# Altium schematic sheet DDR4 Interface.SchDoc
size A2; DocumentNumber: 4; SheetNumber: 4; SheetTotal: 14
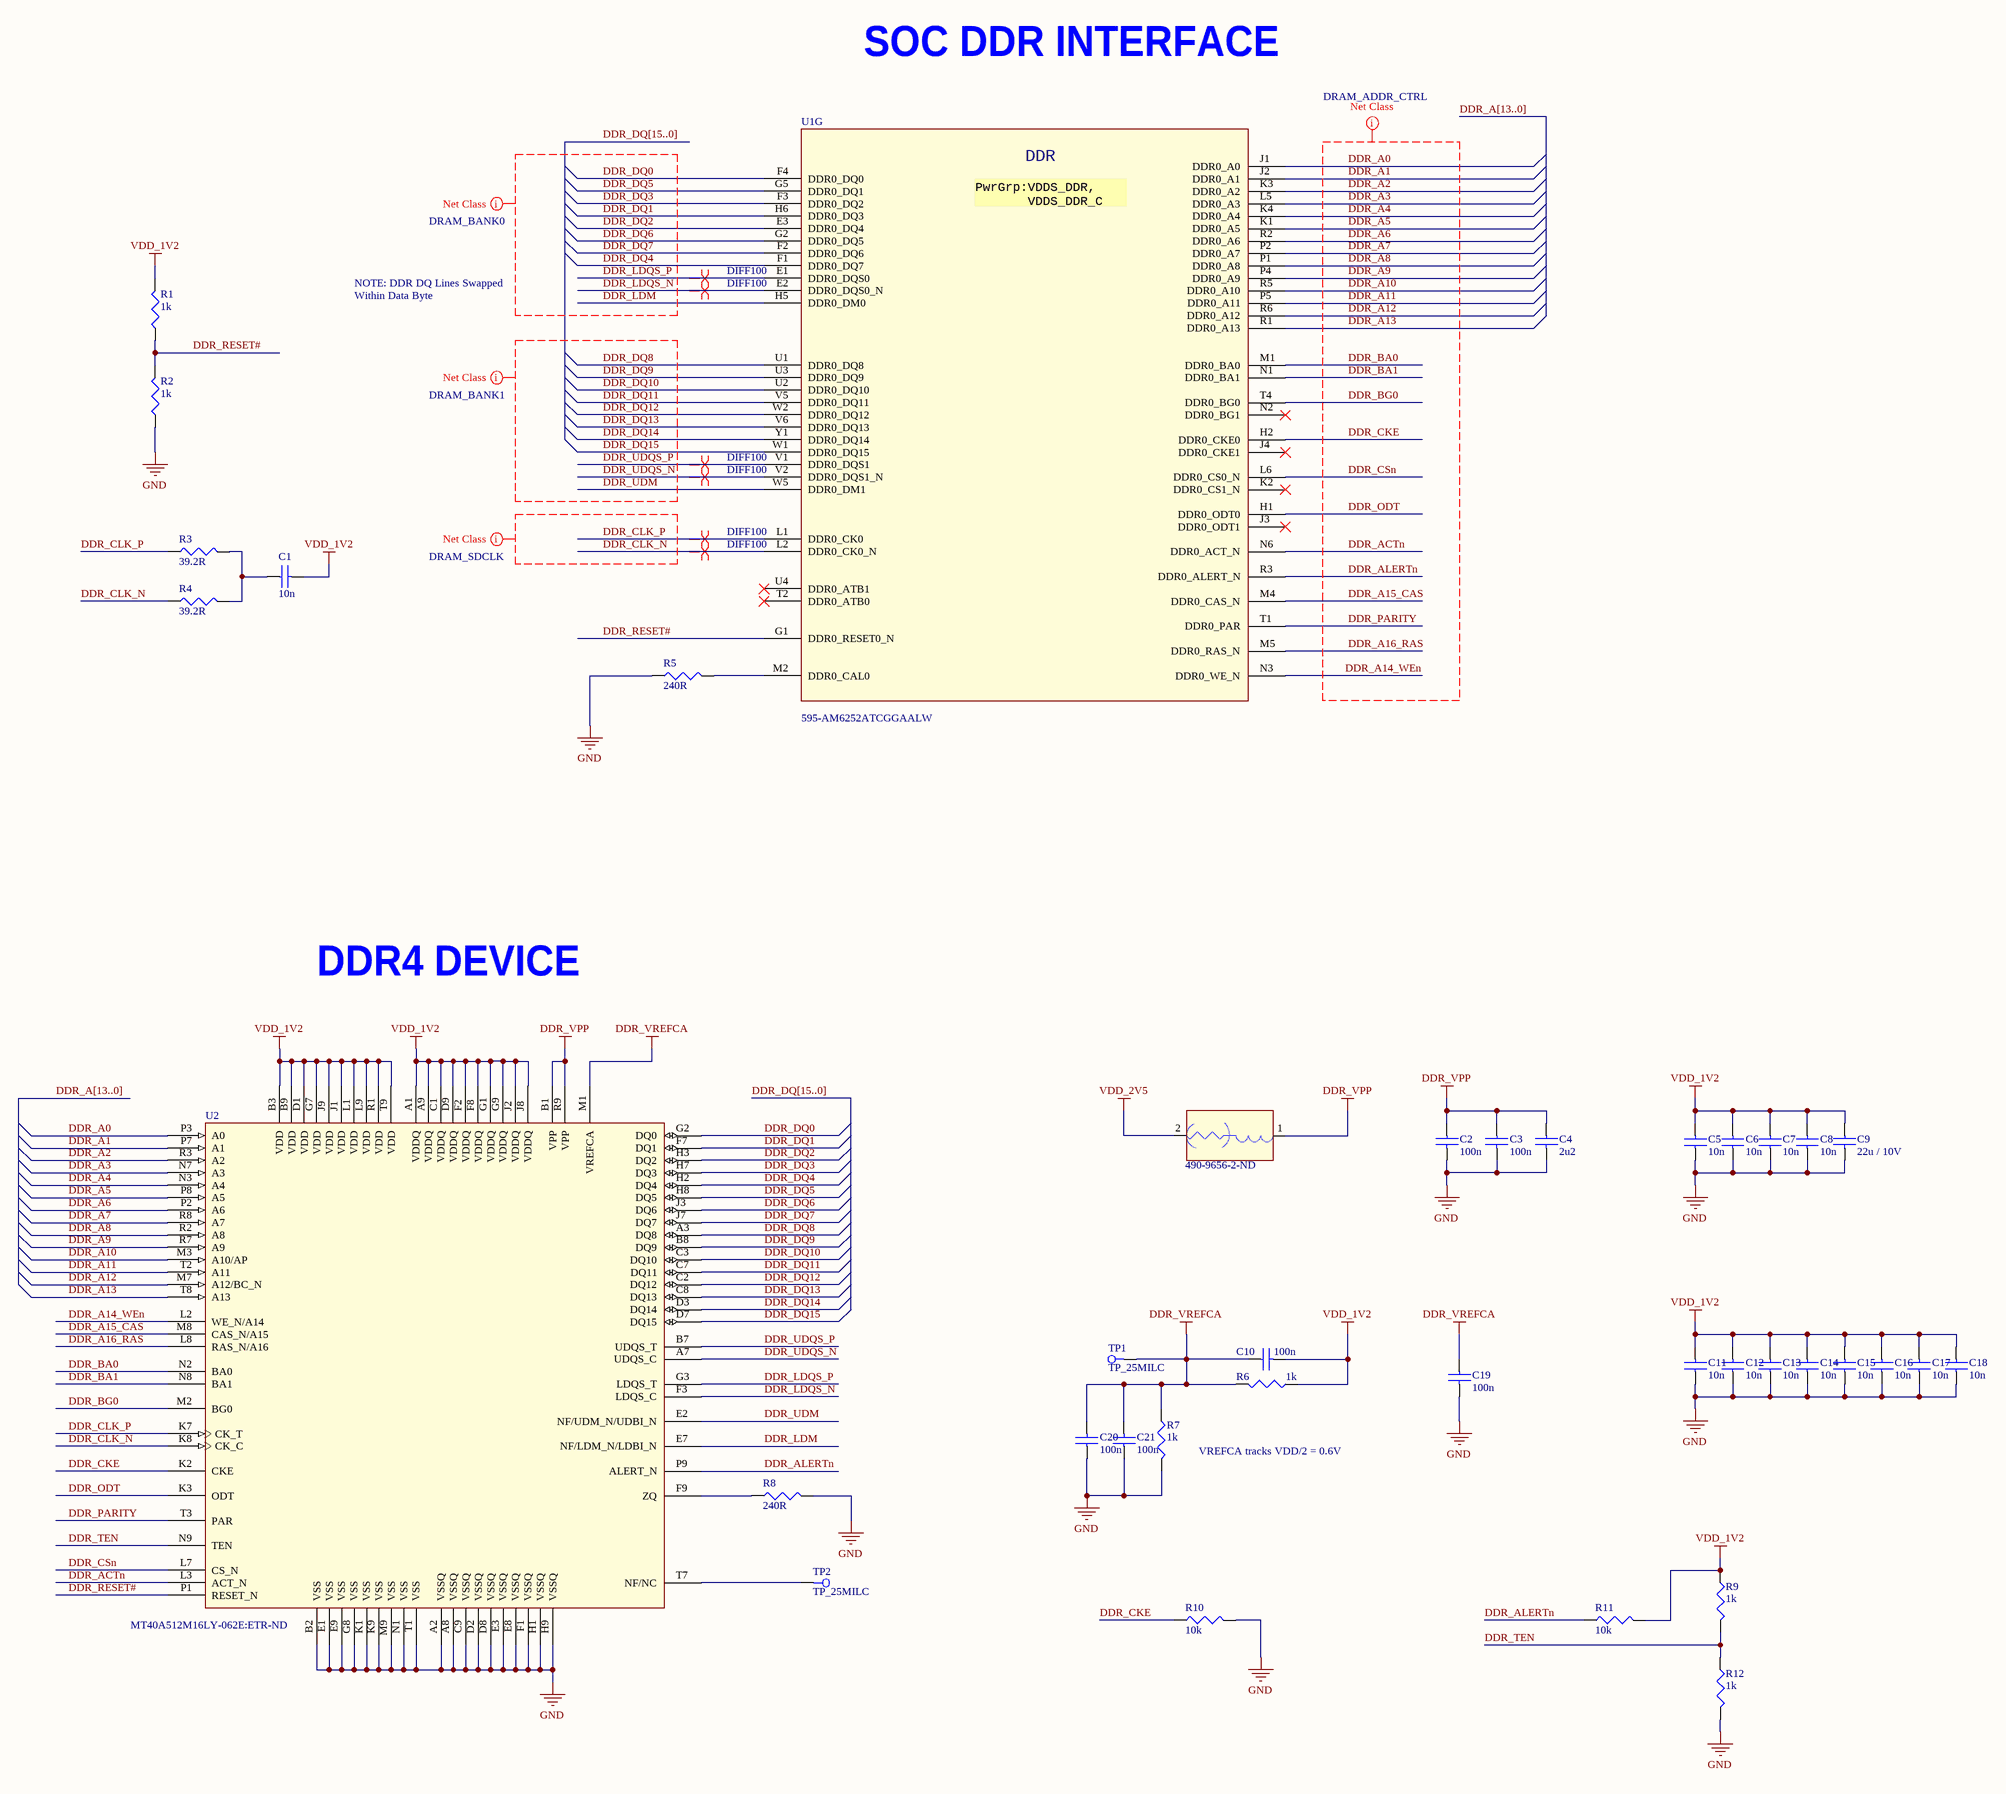
[diagram p0: DDR4 Interface.SchDoc]

## Parts
C1  10n  [C0201]
C2  100n  [C0201]
C3  100n  [C0201]
C4  2u2  [C0402]
C5  10n  [C0201]
C6  10n  [C0201]
C7  10n  [C0201]
C8  10n  [C0201]
C9  22u / 10V  [C0603]
C10  100n  [C0201]
C11  10n  [C0201]
C12  10n  [C0201]
C13  10n  [C0201]
C14  10n  [C0201]
C15  10n  [C0201]
C16  10n  [C0201]
C17  10n  [C0201]
C18  10n  [C0201]
C19  100n  [C0201]
C20  100n  [C0201]
C21  100n  [C0201]
FL1  Supplier Part Number 1: 490-9656-2-ND  [NFZ15SG152SN10B]  (hidden comment: BLM15PX121SN1D)
R1  1k  [R0201]
R2  1k  [R0201]
R3  39.2R  [R0402]
R4  39.2R  [R0402]
R5  240R  [R0201]
R6  1k  [R0201]
R7  1k  [R0201]
R8  240R  [R0402]
R9  1k  [R0201]
R10  10k  [R0201]
R11  10k  [R0201]
R12  1k  [R0201]
TP1  TP_25MILC  [TP_25C]  (no BOM)
TP2  TP_25MILC  [TP_25C]  (no BOM)
U1  Supplier Part Number 1: 595-AM6252ATCGGAALW  [BGA425C50P25X25_1300X1300X89]  (hidden comment: AM62-EVM_BGA425)  (part G of 18)
U2  Supplier Part Number 1: MT40A512M16LY-062E:ETR-ND  [BGA96C80P9X16_750X1350X120]  (hidden comment: MT40A512M16LY_FBGA96)

## Nets
DDR_VPP: C2.1 C3.1 C4.1 FL1.1 U2.B1(VPP) U2.R9(VPP)
DDR_VREFCA: C10.1 C19.1 C20.2 C21.2 R6.2 R7.1 TP1.1 U2.M1(VREFCA)
GND: C2.2 C3.2 C4.2 C5.1 C6.1 C7.1 C8.1 C9.2 C11.1 C12.1 C13.1 C14.1 C15.1 C16.1 C17.1 C18.1 C19.2 C20.1 C21.1 R2.1 R5.1 R7.2 R8.2 R10.2 R12.2 U2.A2(VSSQ) U2.A8(VSSQ) U2.B2(VSS) U2.C9(VSSQ) U2.D2(VSSQ) U2.D8(VSSQ) U2.E1(VSS) U2.E3(VSSQ) U2.E8(VSSQ) U2.E9(VSS) U2.F1(VSSQ) U2.G8(VSS) U2.H1(VSSQ) U2.H9(VSSQ) U2.K1(VSS) U2.K9(VSS) U2.M9(VSS) U2.N1(VSS) U2.T1(VSS)
VDD_1V2: C1.2 C5.2 C6.2 C7.2 C8.2 C9.1 C10.2 C11.2 C12.2 C13.2 C14.2 C15.2 C16.2 C17.2 C18.2 R1.2 R6.1 R9.1 R11.2 U2.A1(VDDQ) U2.A9(VDDQ) U2.B3(VDD) U2.B9(VDD) U2.C1(VDDQ) U2.D1(VDD) U2.D9(VDDQ) U2.F2(VDDQ) U2.F8(VDDQ) U2.G1(VDDQ) U2.G7(VDD) U2.G9(VDDQ) U2.J1(VDD) U2.J2(VDDQ) U2.J8(VDDQ) U2.J9(VDD) U2.L1(VDD) U2.L9(VDD) U2.R1(VDD) U2.T9(VDD)
VDD_2V5: FL1.2
DDR_A0: U1.J1(DDR0_A0) U2.P3(A0)
DDR_A1: U1.J2(DDR0_A1) U2.P7(A1)
DDR_A2: U1.K3(DDR0_A2) U2.R3(A2)
DDR_A3: U1.L5(DDR0_A3) U2.N7(A3)
DDR_A4: U1.K4(DDR0_A4) U2.N3(A4)
DDR_A5: U1.K1(DDR0_A5) U2.P8(A5)
DDR_A6: U1.R2(DDR0_A6) U2.P2(A6)
DDR_A7: U1.P2(DDR0_A7) U2.R8(A7)
DDR_A8: U1.P1(DDR0_A8) U2.R2(A8)
DDR_A9: U1.P4(DDR0_A9) U2.R7(A9)
DDR_A10: U1.R5(DDR0_A10) U2.M3(A10/AP)
DDR_A11: U1.P5(DDR0_A11) U2.T2(A11)
DDR_A12: U1.R6(DDR0_A12) U2.M7(A12/BC_N)
DDR_A13: U1.R1(DDR0_A13) U2.T8(A13)
DDR_A14_WEn: U1.N3(DDR0_WE_N) U2.L2(WE_N/A14)
DDR_A15_CAS: U1.M4(DDR0_CAS_N) U2.M8(CAS_N/A15)
DDR_A16_RAS: U1.M5(DDR0_RAS_N) U2.L8(RAS_N/A16)
DDR_ACTn: U1.N6(DDR0_ACT_N) U2.L3(ACT_N)
DDR_ALERTn: R11.1 U1.R3(DDR0_ALERT_N) U2.P9(ALERT_N)
DDR_BA0: U1.M1(DDR0_BA0) U2.N2(BA0)
DDR_BA1: U1.N1(DDR0_BA1) U2.N8(BA1)
DDR_BG0: U1.T4(DDR0_BG0) U2.M2(BG0)
DDR_CKE: R10.1 U1.H2(DDR0_CKE0) U2.K2(CKE)
DDR_CLK_N: R4.1 U1.L2(DDR0_CK0_N) U2.K8(CK_C)
DDR_CLK_P: R3.1 U1.L1(DDR0_CK0) U2.K7(CK_T)
DDR_CSn: U1.L6(DDR0_CS0_N) U2.L7(CS_N)
DDR_DQ0: U1.F4(DDR0_DQ0) U2.G2(DQ0)
DDR_DQ1: U1.H6(DDR0_DQ3) U2.F7(DQ1)
DDR_DQ2: U1.E3(DDR0_DQ4) U2.H3(DQ2)
DDR_DQ3: U1.F3(DDR0_DQ2) U2.H7(DQ3)
DDR_DQ4: U1.F1(DDR0_DQ7) U2.H2(DQ4)
DDR_DQ5: U1.G5(DDR0_DQ1) U2.H8(DQ5)
DDR_DQ6: U1.G2(DDR0_DQ5) U2.J3(DQ6)
DDR_DQ7: U1.F2(DDR0_DQ6) U2.J7(DQ7)
DDR_DQ8: U1.U1(DDR0_DQ8) U2.A3(DQ8)
DDR_DQ9: U1.U3(DDR0_DQ9) U2.B8(DQ9)
DDR_DQ10: U1.U2(DDR0_DQ10) U2.C3(DQ10)
DDR_DQ11: U1.V5(DDR0_DQ11) U2.C7(DQ11)
DDR_DQ12: U1.W2(DDR0_DQ12) U2.C2(DQ12)
DDR_DQ13: U1.V6(DDR0_DQ13) U2.C8(DQ13)
DDR_DQ14: U1.Y1(DDR0_DQ14) U2.D3(DQ14)
DDR_DQ15: U1.W1(DDR0_DQ15) U2.D7(DQ15)
DDR_LDM: U1.H5(DDR0_DM0) U2.E7(NF/LDM_N/LDBI_N)
DDR_LDQS_N: U1.E2(DDR0_DQS0_N) U2.F3(LDQS_C)
DDR_LDQS_P: U1.E1(DDR0_DQS0) U2.G3(LDQS_T)
DDR_ODT: U1.H1(DDR0_ODT0) U2.K3(ODT)
DDR_PARITY: U1.T1(DDR0_PAR) U2.T3(PAR)
DDR_RESET#: R1.1 R2.2 U1.G1(DDR0_RESET0_N) U2.P1(RESET_N)
DDR_TEN: R9.2 R12.1 U2.N9(TEN)
DDR_UDM: U1.W5(DDR0_DM1) U2.E2(NF/UDM_N/UDBI_N)
DDR_UDQS_N: U1.V2(DDR0_DQS1_N) U2.A7(UDQS_C)
DDR_UDQS_P: U1.V1(DDR0_DQS1) U2.B7(UDQS_T)
NetC1_1: C1.1 R3.2 R4.2
NetR5_2: R5.2 U1.M2(DDR0_CAL0)
NetR8_1: R8.1 U2.F9(ZQ)
NetTP2_1: TP2.1 U2.T7(NF/NC)

Not connected (* = marked no-connect by the designer): U1 J3(DDR0_ODT1)* J4(DDR0_CKE1)* K2(DDR0_CS1_N)* N2(DDR0_BG1)* T2(DDR0_ATB0)* U4(DDR0_ATB1)*

## Buses and harness runs
bus DDR_A[13..0]
bus DDR_DQ[15..0]

## Layout directives
net class DRAM_BANK0: DDR_DQ0, DDR_DQ1, DDR_DQ2, DDR_DQ3, DDR_DQ4, DDR_DQ5, DDR_DQ6, DDR_DQ7, DDR_LDM, DDR_LDQS_N, DDR_LDQS_P
net class DRAM_BANK1: DDR_DQ8, DDR_DQ9, DDR_DQ10, DDR_DQ11, DDR_DQ12, DDR_DQ13, DDR_DQ14, DDR_DQ15, DDR_UDM, DDR_UDQS_N, DDR_UDQS_P
net class DRAM_SDCLK: DDR_CLK_N, DDR_CLK_P
net class DRAM_ADDR_CTRL: DDR_A0, DDR_A1, DDR_A2, DDR_A3, DDR_A4, DDR_A5, DDR_A6, DDR_A7, DDR_A8, DDR_A9, DDR_A10, DDR_A11, DDR_A12, DDR_A13, DDR_A14_WEn, DDR_A15_CAS, DDR_A16_RAS, DDR_ACTn, DDR_ALERTn, DDR_BA0, DDR_BA1, DDR_BG0, DDR_CKE, DDR_CSn, DDR_ODT, DDR_PARITY
differential pair; net class DIFF100: DDR_CLK_N, DDR_CLK_P, DDR_LDQS_N, DDR_LDQS_P, DDR_UDQS_N, DDR_UDQS_P

## Notes on the sheet
- SOC DDR INTERFACE
- NOTE: DDR DQ Lines Swapped
- Within Data Byte
- DDR4 DEVICE
- (near R7) VREFCA tracks VDD/2 = 0.6V
- (in symbol AM62-EVM_BGA425, part G) DDR; PwrGrp:VDDS_DDR, / VDDS_DDR_C

## Library data of the parts
C1 C5-C8 C11-C18 = C0603X5R1C103K030BA: CAP CER .01UF 16V 10% X5R 0201; Manufacturer: TDK Corporation; Capacitance: 10000pF; .Creator: MM; Supplier 1: Digi-Key; Manufacturer Part Number: C0603X5R1C103K030BA; RoHS: RoHS Compliant; Category: Capacitors; Stock 1: 24793; Pricing 1: 1=0.1, 10=0.043, 100=0.0196, 250=0.01608, 500=0.01374, 1000=0.0105, 5000=0.00875 (USD); Packaging: Cut Tape (CT); Tolerance: ±10%; Voltage - Rated: 16V; Temperature Coefficient: X5R; Mounting Type: Surface Mount, MLCC; Operating Temperature: -55°C ~ 85°C; Applications: General Purpose; Ratings: -; Package / Case: 0201 (0603 Metric); Size / Dimension: 0.024" L x 0.012" W (0.60mm x 0.30mm); Height - Seated (Max): -; Thickness (Max): 0.013" (0.33mm); Lead Spacing: -; Features: -; Lead Style: -; ComponentLink1URL: http://product.tdk.com/en/catalog/datasheets/mlcc_commercial_general_en.pdf; ComponentLink1Description: http://product.tdk.com/en/catalog/datasheets/mlcc_commercial_general_en.pdf; Supplier Part Number 1: 445-16166-1-ND; .Checked PCB: MM; .Checked SCH: MM
C2 C3 C10 C19-C21 = C0603X5R1C104K030BC: CAP CER 0.1UF 16V 10% X5R 0201; Manufacturer: TDK Corporation; Capacitance: 0.1µF; .Creator: MM; Supplier 1: Digi-Key; Manufacturer Part Number: C0603X5R1C104K030BC; RoHS: RoHS Compliant; Category: Capacitors; Stock 1: 19491; Pricing 1: 1=0.1, 10=0.046, 100=0.0209, 250=0.01712, 500=0.01464, 1000=0.0114, 5000=0.0095 (USD); Packaging: Cut Tape (CT); Tolerance: ±10%; Voltage - Rated: 16V; Temperature Coefficient: X5R; Mounting Type: Surface Mount, MLCC; Operating Temperature: -55°C ~ 85°C; Applications: General Purpose; Ratings: -; Package / Case: 0201 (0603 Metric); Size / Dimension: 0.024" L x 0.012" W (0.60mm x 0.30mm); Height - Seated (Max): -; Thickness (Max): 0.013" (0.33mm); Lead Spacing: -; Features: -; Lead Style: -; ComponentLink1URL: http://product.tdk.com/en/catalog/datasheets/mlcc_commercial_general_en.pdf; ComponentLink1Description: http://product.tdk.com/en/catalog/datasheets/mlcc_commercial_general_en.pdf; Supplier Part Number 1: 445-7313-1-ND; .Checked PCB: MM; .Checked SCH: MM
C4 = C1005X5R1A225K: CAP CER 2.2UF 10V 10% X5R 0402; Manufacturer: TDK Corporation; Capacitance: 2.2µF; .Checked PCB: used; Supplier 1: Digi-Key; Supplier Part Number 1: 445-7392-1-ND; Manufacturer Part Number: C1005X5R1A225K; RoHS: RoHS Compliant; Category: Capacitors; Stock 1: 22891; Pricing 1: 1=0.42, 10=0.332, 100=0.2, 250=0.15, 500=0.128, 1000=0.1 (USD); Voltage - Rated: 10V; Tolerance: ±10%; Temperature Coefficient: X5R; Mounting Type: Surface Mount, MLCC; Operating Temperature: -55°C ~ 85°C; Applications: General Purpose; Ratings: -; Package / Case: 0402 (1005 Metric); Size / Dimension: 0.039" L x 0.020" W (1.00mm x 0.50mm); Height - Seated (Max): -; Thickness (Max): 0.022" (0.55mm); Lead Spacing: -; Features: -; Packaging: Cut Tape (CT); Lead Style: -; ComponentLink1URL: http://www.tdk.com/pdf/general_B11.pdf; ComponentLink1Description: http://www.tdk.com/pdf/general_B11.pdf; .Checked SCH: used
C9 = C1608X5R1A226M080AC: CAP CER 22UF 10V X5R 0603; Manufacturer: TDK Corporation; Capacitance: 22µF; Tolerance: ±20%; .Creator: MM; Supplier 1: Digi-Key; Manufacturer Part Number: C1608X5R1A226M080AC; RoHS: RoHS Compliant; Category: Capacitors; Stock 1: 405620; Pricing 1: 1=0.49, 10=0.469, 100=0.2275, 250=0.189, 500=0.1715, 1000=0.1575 (USD); Packaging: Cut Tape (CT); Voltage - Rated: 10V; Temperature Coefficient: X5R; Mounting Type: Surface Mount, MLCC; Operating Temperature: -55°C ~ 85°C; Applications: General Purpose; Ratings: -; Package / Case: 0603 (1608 Metric); Size / Dimension: 0.063" L x 0.031" W (1.60mm x 0.80mm); Height - Seated (Max): -; Thickness (Max): 0.035" (0.90mm); Lead Spacing: -; Features: -; Lead Style: -; ComponentLink1URL: http://product.tdk.com/en/catalog/datasheets/mlcc_commercial_general_en.pdf; ComponentLink1Description: http://product.tdk.com/en/catalog/datasheets/mlcc_commercial_general_en.pdf; Supplier Part Number 1: 445-9077-1-ND; .Checked SCH: MM; .Checked PCB: MM
FL1 = BLM15PX121SN1D: FERRITE BEAD 120 OHM 0402 1LN; Manufacturer: Murata; Tolerance: 25%; Impedance: 120R; Current Rating: 2A; Number of Lines: 1; DC Resistance (DCR): 55mR; Test Frequency: 100MHz; Supplier 1: Digi-Key; Manufacturer Part Number: BLM15PX121SN1D; Stock 1: 490000; Pricing 1: 10000=0.0196 (USD); Case/Package: 0402; Number of Pins: 2; Case Code (Metric): 1005; Case Code (Imperial): 0402; Weight: 2.3E-05oz; Material: Steel; Min Operating Temperature: -55°C; Max Operating Temperature: 125°C; Package Quantity: 1; Packaging: Tape and Reel; Max Current Rating: 2A; Termination: SMD/SMT; Max DC Current: 2A; Number of Circuits: 1; Series: EMIFIL®, BLM15P; Length: 1mm; Width: 0.5mm; Height: 0.5mm; Reach SVHC Compliant: Yes; Lead Free: Lead Free; RoHS Compliant: Yes; ComponentLink1URL: https://datasheet.ciiva.com/41449/001172210-da-01-en-drossel-0402-120r-1-0x0-5mm-10000st-41449498.pdf?src-supplier=Conrad; ComponentLink1Description: https://datasheet.ciiva.com/41449/001172210-da-01-en-drossel-0402-120r-1-0x0-5mm-10000st-41449498.pdf?src-supplier=Conrad; ComponentLink2URL: https://datasheet.ciiva.com/41860/l0110e-41860699.pdf?src-supplier=Digi-Key; ComponentLink2Description: https://datasheet.ciiva.com/41860/l0110e-41860699.pdf?src-supplier=Digi-Key; ComponentLink3URL: https://datasheet.ciiva.com/29364/l0110e-29364069.pdf?src-supplier=Digi-Key; ComponentLink3Description: https://datasheet.ciiva.com/29364/l0110e-29364069.pdf?src-supplier=Digi-Key
R1 R2 R6 R7 R9 R12 = RC0201FR-071KL: RES 1K OHM 1/20W 1% 0201 SMD; Manufacturer: Yageo; Power (Watts): 0.05W, 1/20W; Temperature Coefficient: ±200ppm/°C; .Creator: MM; Supplier 1: Digi-Key; Manufacturer Part Number: RC0201FR-071KL; RoHS: RoHS Compliant; Category: Resistors; Stock 1: 0; Pricing 1: 1=0.1, 10=0.074, 25=0.054, 100=0.0303, 250=0.02312, 500=0.0185, 1000=0.01361, 2500=0.01182, 5000=0.00976 (USD); Packaging: Cut Tape (CT); Resistance (Ohms): 1k; Tolerance: ±1%; Composition: Thick Film; Features: Moisture Resistant; Package / Case: 0201 (0603 Metric); Supplier Device Package: 0201; Size / Dimension: 0.024" L x 0.012" W (0.60mm x 0.30mm); Height: 0.010" (0.26mm); Number of Terminations: 2; ComponentLink1URL: http://www.yageo.com/documents/recent/PYu-RC0201_51_RoHS_L_8.pdf; ComponentLink1Description: http://www.yageo.com/documents/recent/PYu-RC0201_51_RoHS_L_8.pdf; Supplier Part Number 1: 311-1KMCT-ND; .Checked PCB: MM; .Checked SCH: MM
R3 R4 = RMCF0402FT39R2: RES 39.2 OHM 1% 1/16W 0402; Manufacturer: Stackpole Electronics; Max Power Dissipation: 63mW; Temperature Coefficient: 100ppm/°C; Supplier 1: Digi-Key; Manufacturer Part Number: RMCF0402FT39R2; Stock 1: 220000; Pricing 1: 10000=0.0028, 20000=0.0025, 30000=0.0023, 50000=0.0021, 100000=0.0019 (USD); Mount: Surface Mount; Case/Package: 0402; Case Code (Metric): 1005; Case Code (Imperial): 0402; Contact Plating: Tin,Matte; Min Operating Temperature: -55°C; Max Operating Temperature: 155°C; Resistance: 39.2R; Tolerance: 1%; Packaging: Tape and Reel; Resistor Type: Thick Film; Number of Terminations: 2; Features: Automotive AEC-Q200; Series: RMCF; Length: 0.039inch; Width: 0.02inch; Height: 0.016inch; Radiation Hardening: No; Lead Free: Lead Free; RoHS Compliant: Yes; ComponentLink1URL: https://www.seielect.com/catalog/SEI-RMCF_RMCP.pdf?src-supplier=Avnet; ComponentLink1Description: https://www.seielect.com/catalog/SEI-RMCF_RMCP.pdf?src-supplier=Avnet; ComponentLink2URL: https://www.seielect.com/catalog/SEI-Packaging.pdf?src-supplier=Digi-Key; ComponentLink2Description: https://www.seielect.com/catalog/SEI-Packaging.pdf?src-supplier=Digi-Key; ComponentLink3URL: https://www.seielect.com/catalog/sei-rmcf_rmcp.pdf?src-supplier=Digi-Key; ComponentLink3Description: https://www.seielect.com/catalog/sei-rmcf_rmcp.pdf?src-supplier=Digi-Key; Supplier Part Number 1: RMCF0402FT39R2TR-ND
R5 = RMCF0201FT240R: RES 240 OHM 1/20W 1% 0201; Manufacturer: Stackpole Electronics Inc; Resistance (Ohms): 240; Power (Watts): 0.05W, 1/20W; Temperature Coefficient: ±200ppm/°C; .Creator: MM; Supplier 1: Digi-Key; Manufacturer Part Number: RMCF0201FT240R; RoHS: RoHS Compliant; Category: Resistors; Stock 1: 37080; Pricing 1: 1=0.12, 10=0.084, 50=0.046, 100=0.035, 250=0.026, 500=0.0192, 1000=0.0128, 2500=0.0108, 5000=0.009 (USD); Packaging: Cut Tape (CT); Tolerance: ±1%; Composition: Thick Film; Features: -; Package / Case: 0201 (0603 Metric); Supplier Device Package: 0201; Size / Dimension: 0.024" L x 0.012" W (0.60mm x 0.30mm); Height: 0.009" (0.24mm); Number of Terminations: 2; ComponentLink1URL: http://www.seielect.com/Catalog/SEI-RMCF_RMCP.pdf; ComponentLink1Description: http://www.seielect.com/Catalog/SEI-RMCF_RMCP.pdf; Supplier Part Number 1: RMCF0201FT240RCT-ND; .Checked PCB: MM; .Checked SCH: MM
R8 = RMCF0402FT240R: RES TF 240 OHM 1% 0.0625W 0402; Manufacturer: Stackpole Electronics Inc; Resistance (Ohms): 240; Power (Watts): 0.063W, 1/16W; .Checked PCB: used; Temperature Coefficient: ±100ppm/°C; Category: Resistors; Supplier Part Number: RMCF0402FT240RCT-ND; Manufacturer Part Number: RMCF0402FT240R; Package / Case: 0402 (1005 Metric); Price 1k [$]: 0.00384; Tolerance: ±1%; Value: 240R; .Checked SCH: used; Supplier: Digikey; Supplier 1: Digi-Key; Supplier Part Number 1: RMCF0402FT240RCT-ND; RoHS: RoHS Compliant; Stock 1: 39860; Pricing 1: 1=0.04, 10=0.025, 50=0.0138, 100=0.0105, 250=0.0078, 500=0.00576, 1000=0.00384 (USD); Composition: Thick Film; Features: -; Size / Dimension: 0.039" L x 0.020" W (1.00mm x 0.50mm); Height: 0.016" (0.40mm); Number of Terminations: 2; Packaging: Cut Tape (CT); ComponentLink1URL: http://www.seielect.com/Catalog/SEI-RMCF.pdf; ComponentLink1Description: http://www.seielect.com/Catalog/SEI-RMCF.pdf
R10 R11 = RC0201FR-0710KL: RES 10K OHM 1/20W 1% 0201 SMD; Manufacturer: Yageo; Power (Watts): 0.05W, 1/20W; Temperature Coefficient: ±200ppm/°C; .Creator: MM; Supplier 1: Digi-Key; Manufacturer Part Number: RC0201FR-0710KL; RoHS: RoHS Compliant; Category: Resistors; Stock 1: 529049; Pricing 1: 1=0.1, 10=0.074, 25=0.054, 100=0.0303, 250=0.02312, 500=0.0185, 1000=0.01361, 2500=0.01182, 5000=0.00976 (USD); Packaging: Cut Tape (CT); Resistance (Ohms): 10k; Tolerance: ±1%; Composition: Thick Film; Features: Moisture Resistant; Package / Case: 0201 (0603 Metric); Supplier Device Package: 0201; Size / Dimension: 0.024" L x 0.012" W (0.60mm x 0.30mm); Height: 0.010" (0.26mm); Number of Terminations: 2; ComponentLink1URL: http://www.yageo.com/documents/recent/PYu-RC0201_51_RoHS_L_8.pdf; ComponentLink1Description: http://www.yageo.com/documents/recent/PYu-RC0201_51_RoHS_L_8.pdf; Supplier Part Number 1: 311-10.0KMCT-ND; .Checked PCB: MM; .Checked SCH: MM
TP1 TP2 = TP_25MILC: Test Point 25mil
U1 = AM62-EVM_BGA425: ARM® Cortex®-A53 Microprocessor IC Sitara™ 2 Core, 64-Bit 1.4GHz 425-FCCSP (13x13); Manufacturer: Texas Instruments; Manufacturer Part Number: AM6252ATCGGAALW; Supplier 1: Mouser; Stock 1: 0; Pricing 1: 1=21.23, 10=19.58, 50=18.7, 100=18.7, 1000=15.94, 10000=15.94 (USD)
U2 = MT40A512M16LY_FBGA96: SDRAM - DDR4 Memory IC 8Gbit Parallel 1.33 GHz 96-FBGA (7.5x13.5); Manufacturer: Micron Technology; Manufacturer Part Number: MT40A512M16LY-062E:E TR; Memory Type: Volatile; Memory Size: 8Gb; Frequency: 1.6GHz; Supplier 1: Digi-Key; Stock 1: 0; Pricing 1: 2000=5.4055 (USD); Mount: Surface Mount; Case/Package: TFBGA; Min Operating Temperature: 0°C; Max Operating Temperature: 95°C; Packaging: Tape and Reel; Series: -; ComponentLink1URL: https://www.micron.com/~/media/documents/products/data-sheet/dram/ddr4/8gb_ddr4_sdram.pdf?src-supplier=Digi-Key; ComponentLink1Description: https://www.micron.com/~/media/documents/products/data-sheet/dram/ddr4/8gb_ddr4_sdram.pdf?src-supplier=Digi-Key; ComponentLink2URL: https://datasheet.octopart.com/MT40A512M16LY-062E%3AE-TR-Micron-datasheet-163656737.pdf?src-supplier=SHENGYU+ELECTRONICShttps://datasheet.octopart.com/MT40A512M16LY-062E%3AE-TR-Micron-datasheet-163656737.pdf?src-supplier=SHENGYU+ELECTRONICS; ComponentLink2Description: https://datasheet.octopart.com/MT40A512M16LY-062E%3AE-TR-Micron-datasheet-163656737.pdf?src-supplier=SHENGYU+ELECTRONICS